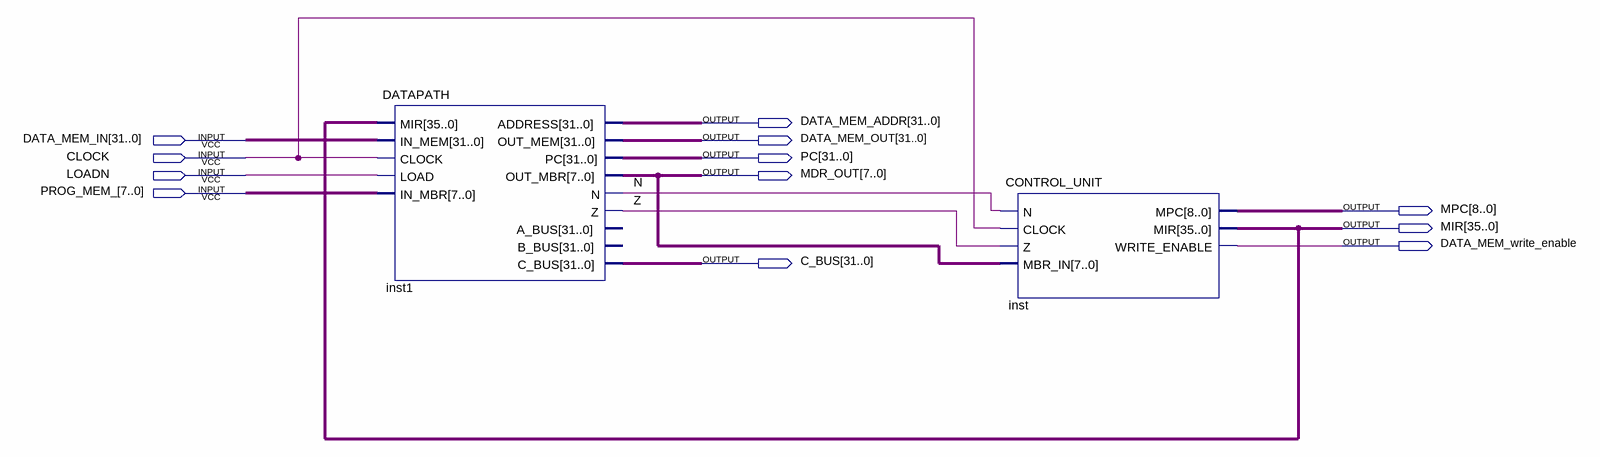
[diagram p0: schematic sheet]
// Quartus schematic CPU.bdf as structural Verilog: 2 symbols, 12 pins
module CPU (
  input  [31:0] DATA_MEM_IN,
  input  CLOCK,
  input  LOADN,
  input  [7:0] PROG_MEM_,
  output [31:0] DATA_MEM_ADDR,
  output [31:0] DATA_MEM_OUT,
  output [31:0] PC,
  output [7:0] MDR_OUT,
  output [8:0] MPC,
  output [35:0] MIR,
  output DATA_MEM_write_enable,
  output [31:0] C_BUS
);

  wire N, Z;

  DATAPATH inst1 (
    .MIR(MIR), .IN_MEM(DATA_MEM_IN), .CLOCK(CLOCK), .LOAD(LOADN), .IN_MBR(PROG_MEM_),
    .ADDRESS(DATA_MEM_ADDR), .OUT_MEM(DATA_MEM_OUT), .PC(PC), .OUT_MBR(MDR_OUT), .N(N), .Z(Z), .C_BUS(C_BUS));  // open: A_BUS, B_BUS
  CONTROL_UNIT inst (
    .N(N), .CLOCK(CLOCK), .Z(Z), .MBR_IN(MDR_OUT), .MPC(MPC), .MIR(MIR), .WRITE_ENABLE(DATA_MEM_write_enable));
endmodule
